# EasyEDA schematic 1-Schematic_Hardware_Space_Systems.json
TITLE: Sheet_1; REV: 1.0; Date: 2023-10-22; Sheet: 1/1; Drawn By: janekspawacz15; Company: Your Company
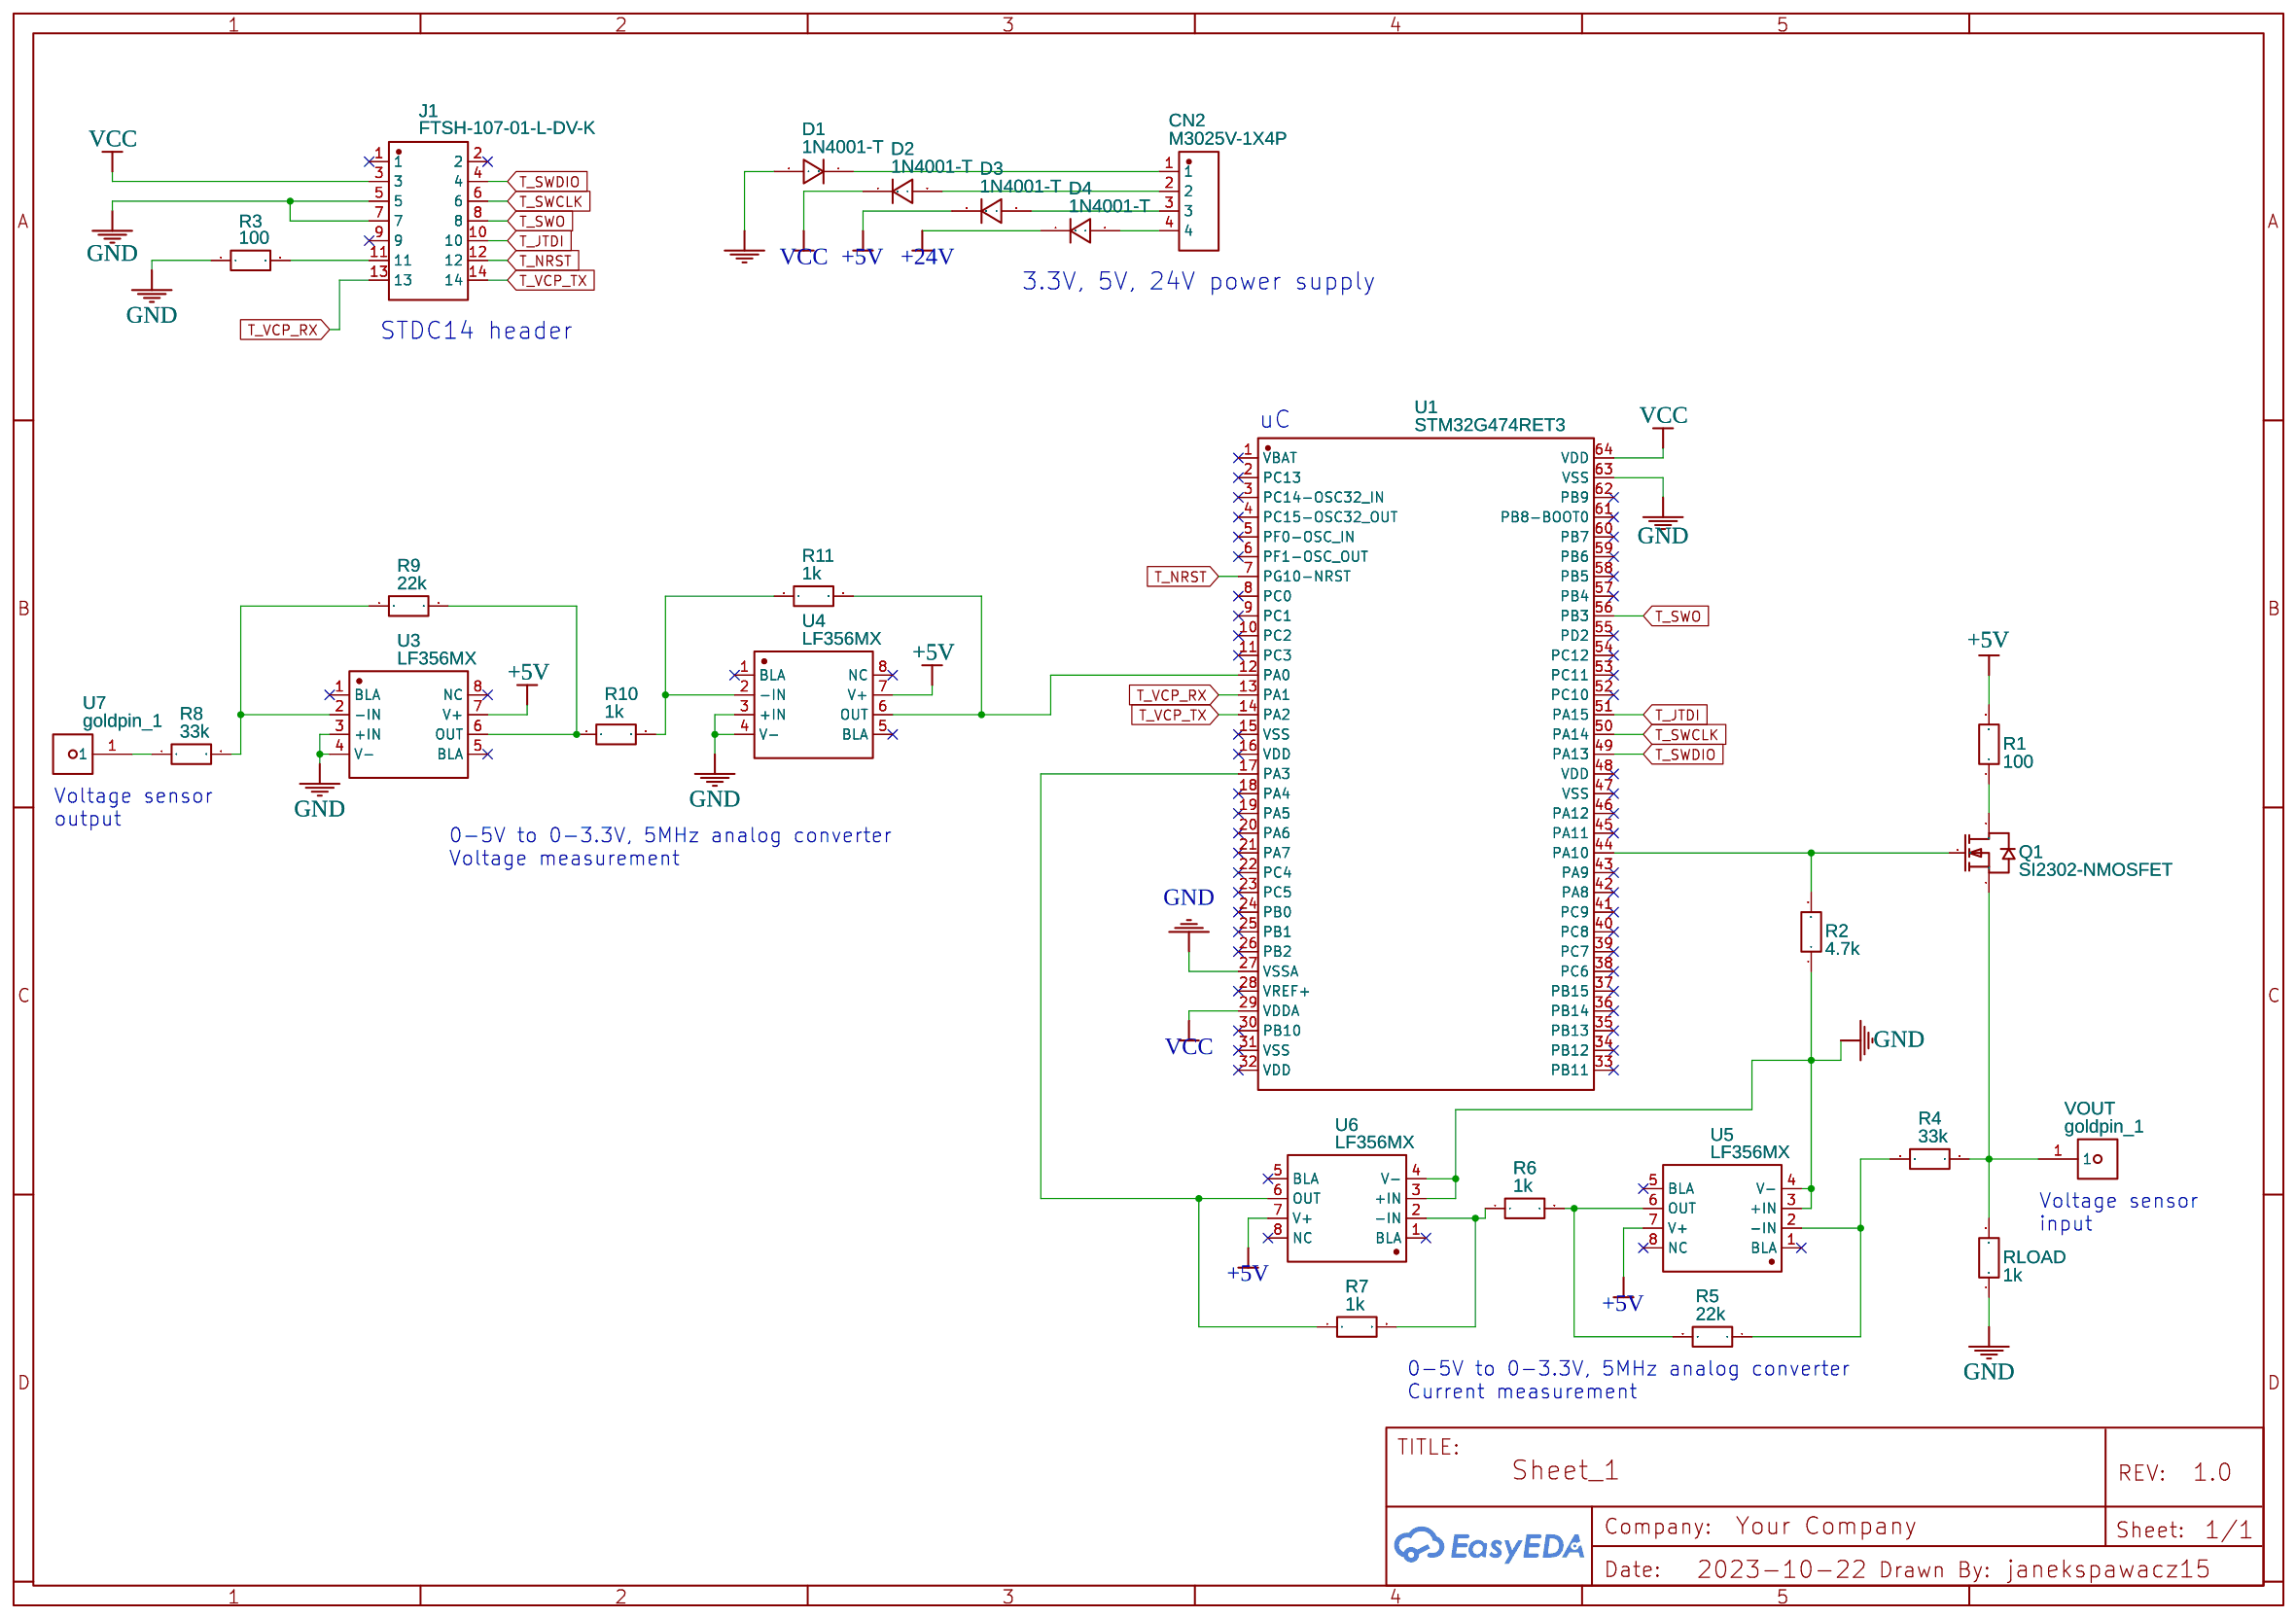
[diagram p0: schematic sheet]

## Parts
CN2  M3025V-1X4P  [CONN-TH_M3025V-1X4P]
D1  1N4001-T  [DO-41_BD2.4-L4.7-P8.70-D0.9-RD]
D2  1N4001-T  [DO-41_BD2.4-L4.7-P8.70-D0.9-RD]
D3  1N4001-T  [DO-41_BD2.4-L4.7-P8.70-D0.9-RD]
D4  1N4001-T  [DO-41_BD2.4-L4.7-P8.70-D0.9-RD]
J1  FTSH-107-01-L-DV-K  [STDC14]
Q1  SI2302-NMOSFET  [SOT-23-3_L2.9-W1.3-P1.90-LS2.4-BR]
R1  100  [R0603]
R2  4.7k  [R0603]
R3  100  [R0603]
R4  33k  [R0603]
R5  22k  [R0603]
R6  1k  [R0603]
R7  1k  [R0603]
R8  33k  [R0603]
R9  22k  [R0603]
R10  1k  [R0603]
R11  1k  [R0603]
RLOAD  1k  [R0603]
U1  STM32G474RET3  [LQFP-64_L10.0-W10.0-P0.50-LS12.0-BL]
U3  LF356MX  [SOP-8_L4.9-W3.9-P1.27-LS6.0-BL]
U4  LF356MX  [SOP-8_L4.9-W3.9-P1.27-LS6.0-BL]
U5  LF356MX  [SOP-8_L4.9-W3.9-P1.27-LS6.0-BL]
U6  LF356MX  [SOP-8_L4.9-W3.9-P1.27-LS6.0-BL]
U7  goldpin_1  [GOLDPIN_1]
VOUT  goldpin_1  [GOLDPIN_1]

## Library data of the parts
CN2 = M3025V-1X4P: Contributor: LCSC; Supplier: LCSC; Supplier Part: C705184; Manufacturer: XFCN(台湾兴飞); Manufacturer Part: M3025V-1x4P; JLCPCB Part Class: Extended Part; link: https://lcsc.com/eda_search?q=C705184&%26type=1&ref=editor
D1-D4 = 1N4001-T: Contributor: LCSC; Supplier: LCSC; Supplier Part: C99656; Manufacturer: DIODES(美台); JLCPCB Part Class: Extended Part; link: https://lcsc.com/eda_search?q=C99656&%26type=1&ref=editor
J1 = FTSH-107-01-L-DV-K: Manufacturer: Samtec; Supplier: Farnell; Supplier Part: 2856443; Contributor: DLMQT; Prix: 3.05; Link: https://fr.farnell.com/samtec/ftsh-107-01-l-dv-k/conn-header-14-voies-2-rangs-1/dp/2856443?st=ftsh-107-01-l-dv-k
Q1 = SI2302-NMOSFET: Contributor: LCSC; Supplier: LCSC; Supplier Part: C9900002167; Manufacturer: null; Manufacturer Part: si2302-nmosfet; JLCPCB Part Class: Extended Part; link: https://lcsc.com/eda_search?q=C9900002167&%26type=1&ref=editor
R1-R11 RLOAD = R_0603_EU: Contributor: LCEDA_Lib
U1 = STM32G474RET3: Contributor: LCSC; Supplier: LCSC; Supplier Part: C1236669; Manufacturer: ST(意法半导体); JLCPCB Part Class: Extended Part; link: https://lcsc.com/eda_search?q=C1236669&%26type=1&ref=editor
U3-U6 = LF356MX: Supplier: LCSC; Manufacturer: TI(德州仪器); Manufacturer Part: LF356MX/NOPB; Supplier Part: C26861; JLCPCB Part Class: Extended Part; link: https://lcsc.com/eda_search?q=C26861&%26type=1&ref=editor
U7 VOUT = goldpin_1: Contributor: skaytrool

## Nets
+5V: D3.1(C) R1.2 U3.7(V+) U4.7(V+) U5.7(V+) U6.7(V+)
+24V: D4.1(C)
GND: D1.2(A) J1.5 J1.7 R2.1 R3.1 RLOAD.1 U1.27(VSSA) U1.63(VSS) U3.3(+IN) U3.4(V-) U4.3(+IN) U4.4(V-) U5.3(+IN) U5.4(V-) U6.3(+IN) U6.4(V-)
VCC: D2.1(C) J1.3 U1.29(VDDA) U1.64(VDD)
T_JTDI: J1.10 U1.51(PA15)
T_NRST: J1.12 U1.7(PG10-NRST)
T_SWCLK: J1.6 U1.50(PA14)
T_SWDIO: J1.4 U1.49(PA13)
T_SWO: J1.8 U1.56(PB3)
T_VCP_RX: J1.13 U1.13(PA1)
T_VCP_TX: J1.14 U1.14(PA2)
Net-(CN2-1): CN2.1 D1.1(C)
Net-(CN2-2): CN2.2 D2.2(A)
Net-(CN2-3): CN2.3 D3.2(A)
Net-(CN2-4): CN2.4 D4.2(A)
Net-(J1-11): J1.11 R3.2
Net-(Q1-1): Q1.1(G) R2.2 U1.44(PA10)
Net-(Q1-2): Q1.2(S) R4.1 RLOAD.2 VOUT.1
Net-(Q1-3): Q1.3(D) R1.1
Net-(R4-2): R4.2 R5.1 U5.2(-IN)
Net-(R5-2): R5.2 R6.2 U5.6(OUT)
Net-(R6-1): R6.1 R7.2 U6.2(-IN)
Net-(R7-1): R7.1 U1.17(PA3) U6.6(OUT)
Net-(R8-1): R8.1 U7.1
Net-(R8-2): R8.2 R9.1 U3.2(-IN)
Net-(R9-2): R9.2 R10.1 U3.6(OUT)
Net-(R10-2): R10.2 R11.1 U4.2(-IN)
Net-(R11-2): R11.2 U1.12(PA0) U4.6(OUT)

Not connected (* = marked no-connect by the designer): J1 1* 2* 9*; U1 1(VBAT)* 2(PC13)* 3(PC14-OSC32_IN)* 4(PC15-OSC32_OUT)* 5(PF0-OSC_IN)* 6(PF1-OSC_OUT)* 8(PC0)* 9(PC1)* 10(PC2)* 11(PC3)* 15(VSS)* 16(VDD)* 18(PA4)* 19(PA5)* 20(PA6)* 21(PA7)* 22(PC4)* 23(PC5)* 24(PB0)* 25(PB1)* 26(PB2)* 28(VREF+)* 30(PB10)* 31(VSS)* 32(VDD)* 33(PB11)* 34(PB12)* 35(PB13)* 36(PB14)* 37(PB15)* 38(PC6)* 39(PC7)* 40(PC8)* 41(PC9)* 42(PA8)* 43(PA9)* 45(PA11)* 46(PA12)* 47(VSS)* 48(VDD)* 52(PC10)* 53(PC11)* 54(PC12)* 55(PD2)* 57(PB4)* 58(PB5)* 59(PB6)* 60(PB7)* 61(PB8-BOOT0)* 62(PB9)*; U3 1(BLA)* 5(BLA)* 8(NC)*; U4 1(BLA)* 5(BLA)* 8(NC)*; U5 1(BLA)* 5(BLA)* 8(NC)*; U6 1(BLA)* 5(BLA)* 8(NC)*

## Notes on the sheet
- 3.3V, 5V, 24V power supply
- STDC14 header
- uC
- Voltage sensor
  output
- 0-5V to 0-3.3V, 5MHz analog converter
  Voltage measurement
- Voltage sensor
  input
- 0-5V to 0-3.3V, 5MHz analog converter
  Current measurement
